# Altium schematic sheet Shematic.SchDoc
size Letter
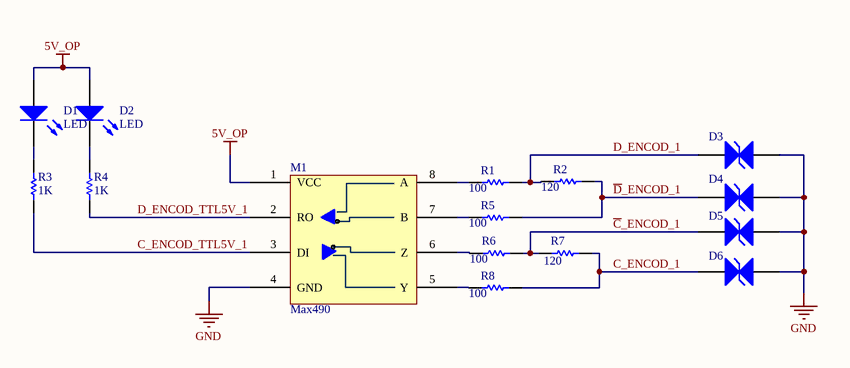
[diagram p0: Shematic.SchDoc]

## Parts
D1  LED
D2  LED
D3  Diode_ESD  (value not drawn)
D4  Diode_ESD  (value not drawn)
D5  Diode_ESD  (value not drawn)
D6  Diode_ESD  (value not drawn)
M1  Max490  [Max490]
R1  value 100  (hidden comment: Res)
R2  value 120  (hidden comment: Res)
R3  value 1K  (hidden comment: Res)
R4  value 1K  (hidden comment: Res)
R5  value 100  (hidden comment: Res)
R6  value 100  (hidden comment: Res)
R7  value 120  (hidden comment: Res)
R8  value 100  (hidden comment: Res)

## Nets
5V_OP: D1.1(A) D2.1(A) M1.1(VCC)
GND: D3.1(A) D4.1(A) D5.1(A) D6.1(A) M1.4(GND)
~{C}_ENCOD_1: D5.2(K) R6.2 R7.1
C_ENCOD_1: D6.2(K) R7.2 R8.2
C_ENCOD_TTL5V_1: M1.3(DI) R3.1
~{D}_ENCOD_1: D4.2(K) R2.2 R5.2
D_ENCOD_1: D3.2(K) R1.2 R2.1
D_ENCOD_TTL5V_1: M1.2(RO) R4.1
NetD1_2: D1.2(K) R3.2
NetD2_2: D2.2(K) R4.2
NetM1_5: M1.5(Y) R8.1
NetM1_6: M1.6(Z) R6.1
NetM1_7: M1.7(B) R5.1
NetM1_8: M1.8(A) R1.1

## Library data of the parts
D1 D2 = LED0: Typical INFRARED GaAs LED; Published: 8-Jun-2000; LatestRevisionDate: 08-Jul-2005; LatestRevisionNote: Mech Layer 1 removed.; PackageReference: LED-0; Publisher: Altium Limited; PackageDescription: LED; 2 Leads
D3-D6 = Diode_ESD: ESD Biderction Diode. SMB Package. 6volt.
M1 = Max490: Single Transmitter/Receiver RS-422/RS-485 8-Pin SOIC N; Manufacturer: Maxim; Manufacturer Part Number: MAX490ESA+; Supplier 1: Mouser; RoHS: Yes; Category: RS-232 / RS-422 / RS-485 Interface ICs; Stock 1: 1490; Pricing 1: 1=5.7, 10=4.85, 50=4.85, 100=4.19, 1000=3.26, 10000=3.19 (USD); ComponentLink1URL: https://datasheet.ciiva.com/4786/max1487-max491-96074-4786046.pdf?src-supplier=Mouser; ComponentLink1Description: https://datasheet.ciiva.com/4786/max1487-max491-96074-4786046.pdf?src-supplier=Mouser; ComponentLink2URL: https://datasheet.ciiva.com/14430/max1487-max491-14430895.pdf?src-supplier=Avnet; ComponentLink2Description: https://datasheet.ciiva.com/14430/max1487-max491-14430895.pdf?src-supplier=Avnet; ComponentLink3URL: https://datasheet.ciiva.com/3028/max1487-max491-3028673.pdf?src-supplier=Avnet; ComponentLink3Description: https://datasheet.ciiva.com/3028/max1487-max491-3028673.pdf?src-supplier=Avnet; ComponentLink4URL: https://datasheet.ciiva.com/1713/max1487-max491-1713335.pdf?src-supplier=Digi-Key; ComponentLink4Description: https://datasheet.ciiva.com/1713/max1487-max491-1713335.pdf?src-supplier=Digi-Key; Supplier Part Number 1: 700-MAX490ESA
R1-R8 = Res1: Resistor; Published: 8-Jun-2000; LatestRevisionDate: 17-Jul-2002; LatestRevisionNote: Re-released for DXP Platform.; PackageReference: AXIAL-0.3; Publisher: Altium Limited; PackageDescription: Axial Device, Thru-Hole; 2 Leads; 0.3 in Pin Spacing